# Altium schematic sheet pwr.SchDoc
size A3; SheetNumber: 1; SheetTotal: 4
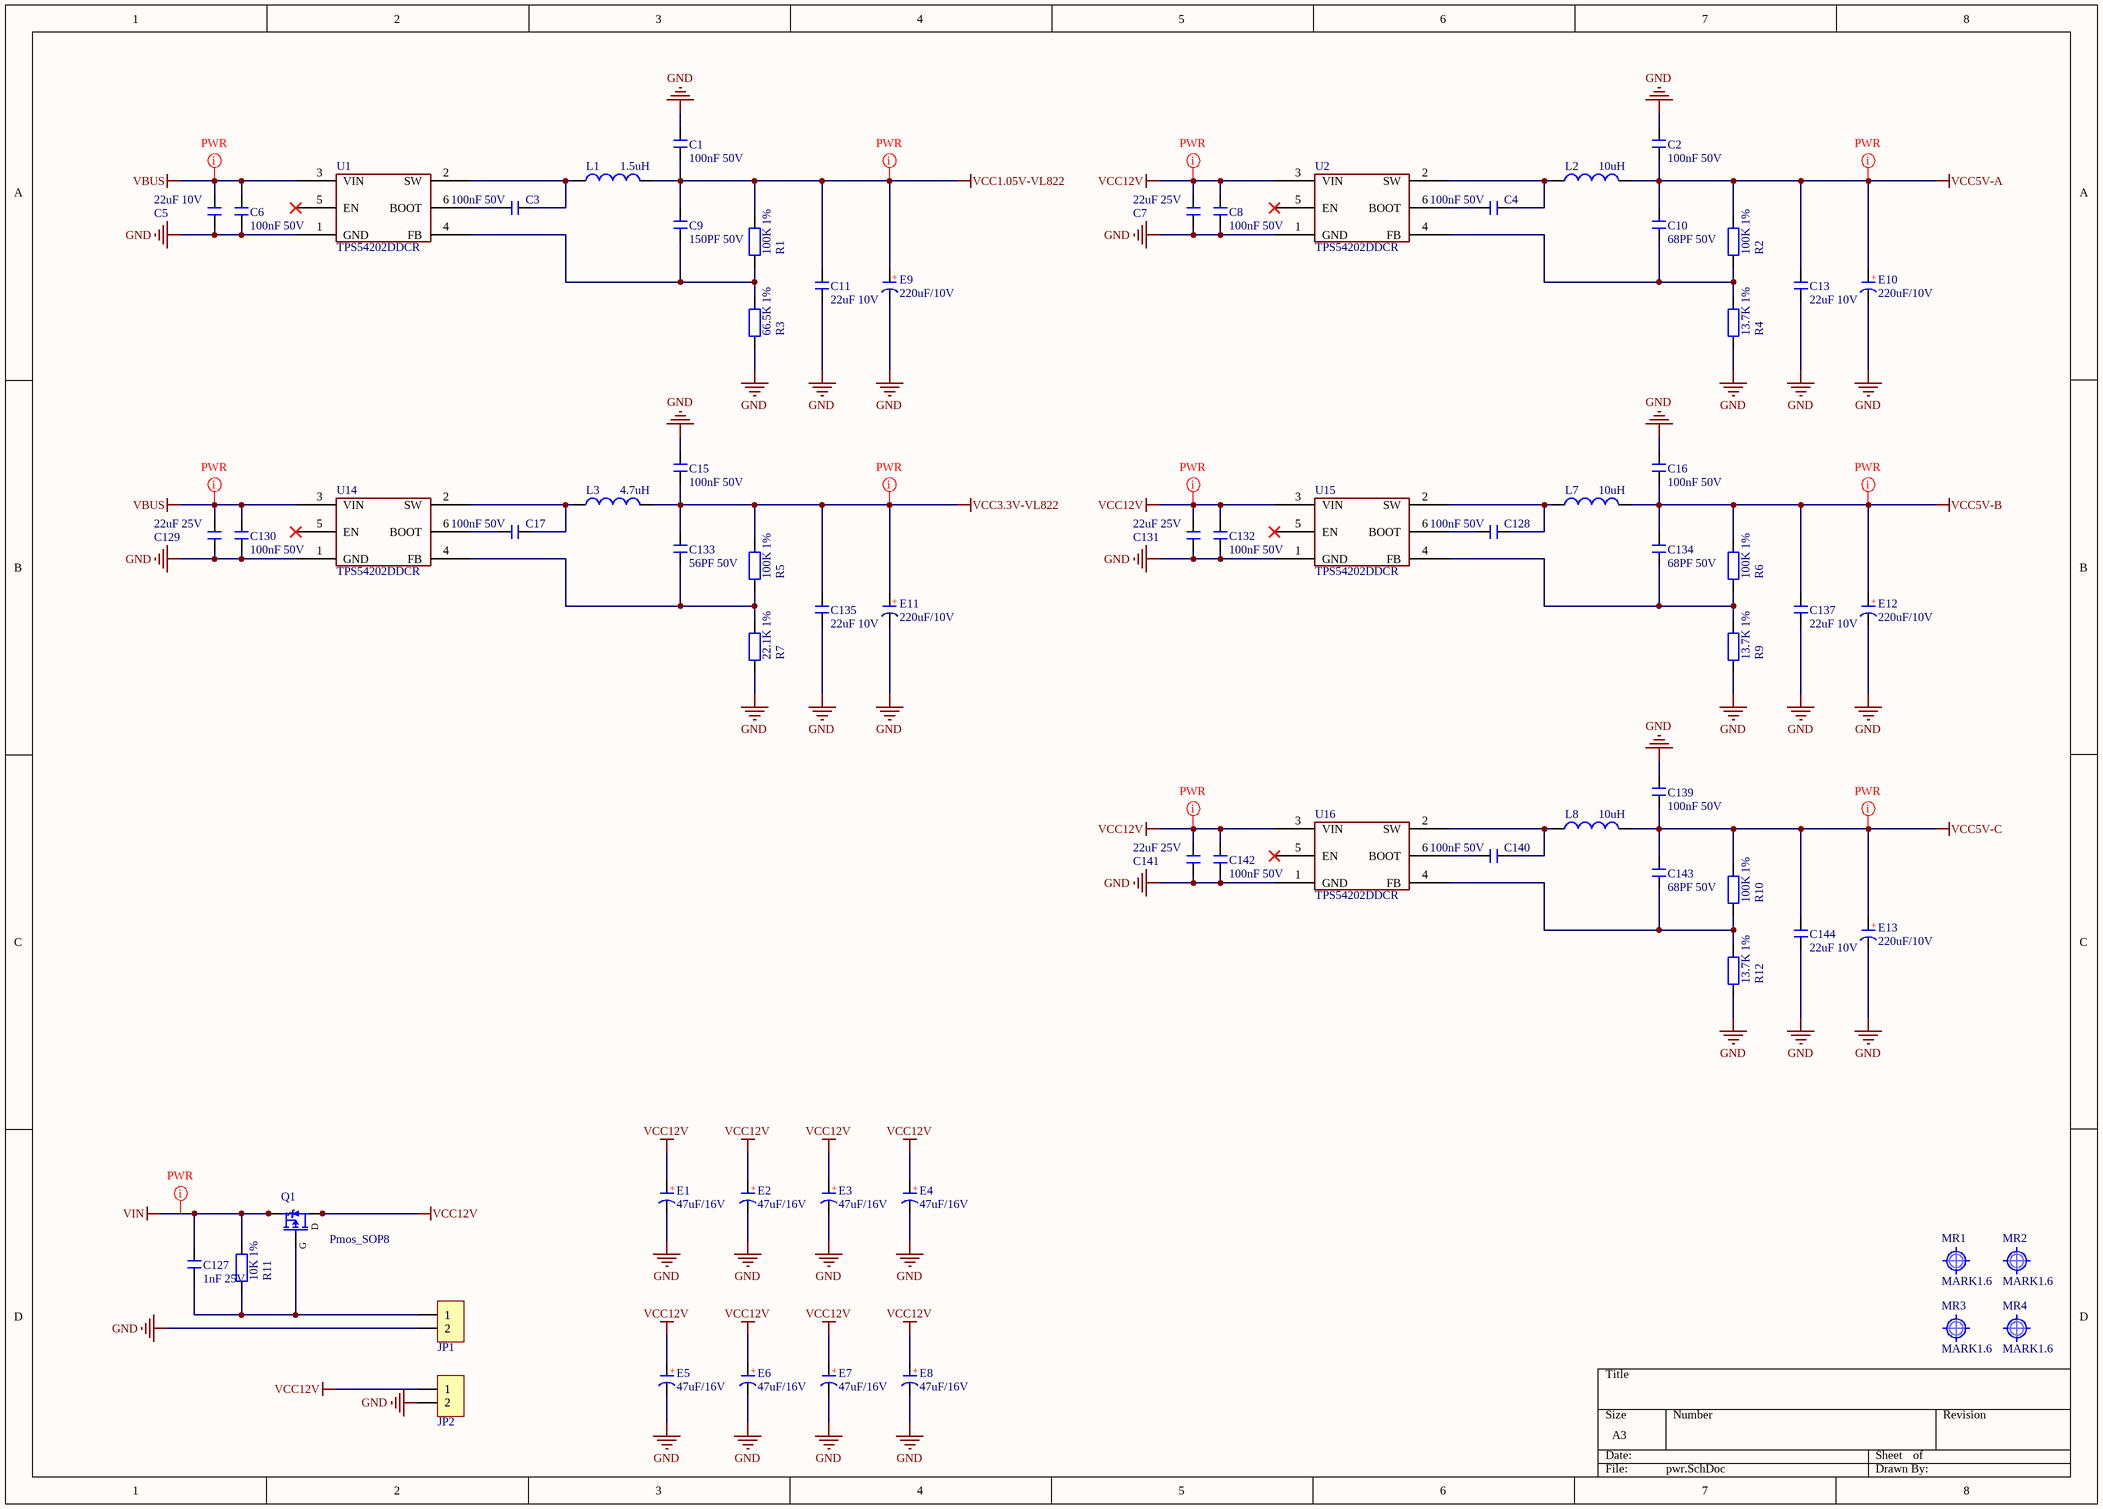
[diagram p0: pwr.SchDoc]

## Parts
C1  100nF 50V  [C0402_L]
C2  100nF 50V  [C0402_L]
C3  100nF 50V  [C0402_L]
C4  100nF 50V  [C0402_L]
C5  22uF 10V  [C0805_L]
C6  100nF 50V  [C0402_L]
C7  22uF 25V  [C0805_L]
C8  100nF 50V  [C0402_L]
C9  150PF 50V  [C0402_L]
C10  68PF 50V  [C0402_L]
C11  22uF 10V  [C0603_L]
C13  22uF 10V  [C0603_L]
C15  100nF 50V  [C0402_L]
C16  100nF 50V  [C0402_L]
C17  100nF 50V  [C0402_L]
C127  1nF 25V  [C0402_L]
C128  100nF 50V  [C0402_L]
C129  22uF 25V  [C0805_L]
C130  100nF 50V  [C0402_L]
C131  22uF 25V  [C0805_L]
C132  100nF 50V  [C0402_L]
C133  56PF 50V  [C0402_L]
C134  68PF 50V  [C0402_L]
C135  22uF 10V  [C0603_L]
C137  22uF 10V  [C0603_L]
C139  100nF 50V  [C0402_L]
C140  100nF 50V  [C0402_L]
C141  22uF 25V  [C0805_L]
C142  100nF 50V  [C0402_L]
C143  68PF 50V  [C0402_L]
C144  22uF 10V  [C0603_L]
E1  47uF/16V  [CS 6*4 - R]
E2  47uF/16V  [CS 6*4 - R]
E3  47uF/16V  [CS 6*4 - R]
E4  47uF/16V  [CS 6*4 - R]
E5  47uF/16V  [CS 6*4 - R]
E6  47uF/16V  [CS 6*4 - R]
E7  47uF/16V  [CS 6*4 - R]
E8  47uF/16V  [CS 6*4 - R]
E9  220uF/10V  [CS 6*4 - B]
E10  220uF/10V  [CS 6*4 - B]
E11  220uF/10V  [CS 6*4 - B]
E12  220uF/10V  [CS 6*4 - B]
E13  220uF/10V  [CS 6*4 - B]
JP1  HDR-1X2  [ZH1.5-WS-2P]  (value not drawn)
JP2  HDR-1X2  [XH2.54-WS-2P]  (value not drawn)
L1  1.5uH  [SMMS0420]
L2  10uH  [SMMS0420]
L3  4.7uH  [SMMS0420]
L7  10uH  [SMMS0420]
L8  10uH  [SMMS0420]
MR1  MARK1.6  [Mark 1]
MR2  MARK1.6  [Mark 1]
MR3  MARK1.6  [Mark 1]
MR4  MARK1.6  [Mark 1]
Q1  Pmos_SOP8  [SOP8_L]
R1  100K 1%  [R0402_L]
R2  100K 1%  [R0402_L]
R3  66.5K 1%  [R0402_L]
R4  13.7K 1%  [R0402_L]
R5  100K 1%  [R0402_L]
R6  100K 1%  [R0402_L]
R7  22.1K 1%  [R0402_L]
R9  13.7K 1%  [R0402_L]
R10  100K 1%  [R0402_L]
R11  10K 1%  [R0402_L]
R12  13.7K 1%  [R0402_L]
U1  TPS54202DDCR  [SOT23-6L]
U2  TPS54202DDCR  [SOT23-6L]
U14  TPS54202DDCR  [SOT23-6L]
U15  TPS54202DDCR  [SOT23-6L]
U16  TPS54202DDCR  [SOT23-6L]

## Nets
GND: C1.2 C2.2 C5.1 C6.1 C7.1 C8.1 C11.2 C13.2 C15.2 C16.2 C129.1 C130.1 C131.1 C132.1 C135.2 C137.2 C139.2 C141.1 C142.1 C144.2 E1.2(K) E2.2(K) E3.2(K) E4.2(K) E5.2(K) E6.2(K) E7.2(K) E8.2(K) E9.2(K) E10.2(K) E11.2(K) E12.2(K) E13.2(K) JP1.2 JP2.2 R3.2 R4.2 R7.2 R9.2 R12.2 U1.1(GND) U2.1(GND) U14.1(GND) U15.1(GND) U16.1(GND)
VBUS: C5.2 C6.2 C129.2 C130.2 U1.3(VIN) U14.3(VIN)
VCC1.05V-VL822: C1.1 C9.2 C11.1 E9.1(A) L1.2 R1.1
VCC3.3V-VL822: C15.1 C133.2 C135.1 E11.1(A) L3.2 R5.1
VCC5V-A: C2.1 C10.2 C13.1 E10.1(A) L2.2 R2.1
VCC5V-B: C16.1 C134.2 C137.1 E12.1(A) L7.2 R6.1
VCC5V-C: C139.1 C143.2 C144.1 E13.1(A) L8.2 R10.1
VCC12V: C7.2 C8.2 C131.2 C132.2 C141.2 C142.2 E1.1(A) E2.1(A) E3.1(A) E4.1(A) E5.1(A) E6.1(A) E7.1(A) E8.1(A) JP2.1 Q1.5(D) Q1.6(D) Q1.7(D) Q1.8(D) U2.3(VIN) U15.3(VIN) U16.3(VIN)
VIN: C127.1 Q1.1(S) Q1.2(S) Q1.3(S) R11.1
NetC3_1: C3.1 U1.6(BOOT)
NetC3_2: C3.2 L1.1 U1.2(SW)
NetC4_1: C4.1 U2.6(BOOT)
NetC4_2: C4.2 L2.1 U2.2(SW)
NetC9_1: C9.1 R1.2 R3.1 U1.4(FB)
NetC10_1: C10.1 R2.2 R4.1 U2.4(FB)
NetC17_1: C17.1 U14.6(BOOT)
NetC17_2: C17.2 L3.1 U14.2(SW)
NetC127_2: C127.2 JP1.1 Q1.4(G) R11.2
NetC128_1: C128.1 U15.6(BOOT)
NetC128_2: C128.2 L7.1 U15.2(SW)
NetC133_1: C133.1 R5.2 R7.1 U14.4(FB)
NetC134_1: C134.1 R6.2 R9.1 U15.4(FB)
NetC140_1: C140.1 U16.6(BOOT)
NetC140_2: C140.2 L8.1 U16.2(SW)
NetC143_1: C143.1 R10.2 R12.1 U16.4(FB)

Not connected (* = marked no-connect by the designer): U1 5(EN)*; U2 5(EN)*; U14 5(EN)*; U15 5(EN)*; U16 5(EN)*

## Layout directives
net class PWR: VBUS, VCC1.05V-VL822, VCC3.3V-VL822, VCC5V-A, VCC5V-B, VCC5V-C, VCC12V, VIN

## Notes on the sheet
- (in symbol C-CD) +

## Library data of the parts
C1-C11 C13 C15-C17 C127-C135 C137 C139-C144 = C: 无极性贴片电容; 版权归属: 源创客; 材质: X7R; BOM名称: 无极性贴片电容; 学习资源: www.ooocke.com
E1-E13 = C-CD: 贴片电解电容; BOM名称: 贴片钽电容; 版权归属: 源创客; 学习资源: www.ooocke.com
JP1 JP2 = Header 2: 2P接插件; 版权归属: 源创客; BOM名称: 2P接插件; 学习资源: www.ooocke.com
L1-L3 L7 L8 = L: 小功率贴片电感; 版权归属: 源创客; BOM名称: 小功率贴片电感; 学习资源: www.ooocke.com
MR1-MR4 = MARK: 光学定位点; 版权归属: 源创客; BOM名称: 光学定位点; 学习资源: www.ooocke.com
Q1 = Pmos_SOP8: BOM名称: 场效应管; 版权归属: 源创客; 描述: P沟道 30V/4.2A; 学习资源: www.ooocke.com
R1-R7 R9-R12 = R: 贴片电阻; 版权归属: 源创客; BOM名称: 贴片电阻; 学习资源: www.ooocke.com
U1 U2 U14-U16 = TPS54202DDCR: DCDC Convert